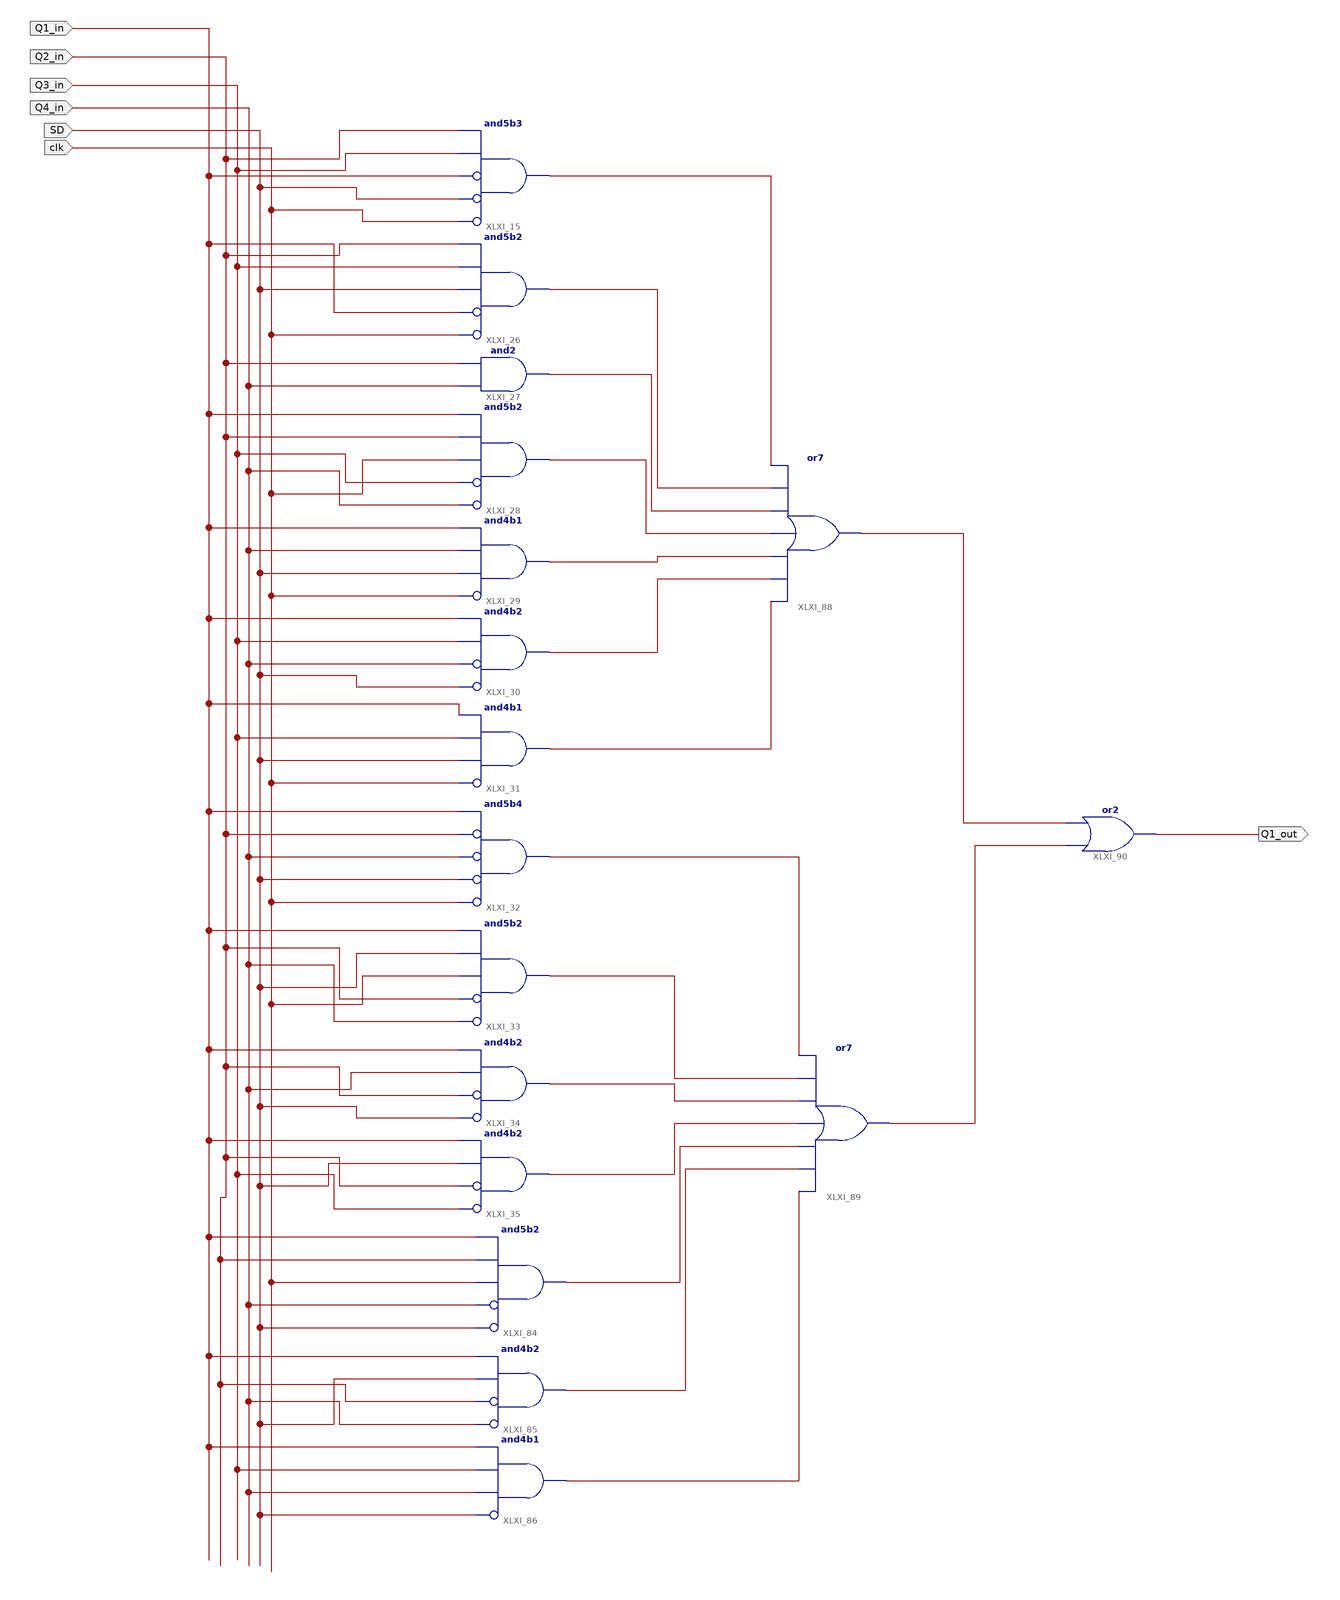
[diagram p0: schematic sheet 1]
// Xilinx ISE schematic Q1_schematic.sch (spartan6) as structural Verilog: 17 symbols, 7 ports
module Q1_schematic (
  input  Q1_in,
  input  Q2_in,
  input  Q3_in,
  input  Q4_in,
  input  clk,
  input  SD,
  output Q1_out
);

  wire XLXN_37, XLXN_38, XLXN_39, XLXN_40, XLXN_41, XLXN_42, XLXN_43, XLXN_44, XLXN_45, XLXN_46, XLXN_47,
       XLXN_48, XLXN_49, XLXN_50, XLXN_51, XLXN_52;

  and XLXI_26 (XLXN_38, ~clk, ~Q1_in, SD, Q3_in, Q2_in);  // and5b2
  and XLXI_27 (XLXN_39, Q4_in, Q2_in);
  and XLXI_28 (XLXN_40, ~Q4_in, ~Q3_in, clk, Q2_in, Q1_in);  // and5b2
  and XLXI_29 (XLXN_41, ~clk, SD, Q4_in, Q1_in);  // and4b1
  and XLXI_30 (XLXN_42, ~SD, ~Q4_in, Q3_in, Q1_in);  // and4b2
  and XLXI_31 (XLXN_43, ~clk, SD, Q3_in, Q1_in);  // and4b1
  and XLXI_32 (XLXN_44, ~clk, ~SD, ~Q4_in, ~Q2_in, Q1_in);  // and5b4
  and XLXI_33 (XLXN_45, ~Q4_in, ~Q2_in, clk, SD, Q1_in);  // and5b2
  and XLXI_34 (XLXN_46, ~SD, ~Q2_in, Q4_in, Q1_in);  // and4b2
  and XLXI_35 (XLXN_47, ~Q3_in, ~Q2_in, SD, Q1_in);  // and4b2
  and XLXI_15 (XLXN_37, ~clk, ~SD, ~Q1_in, Q3_in, Q2_in);  // and5b3
  and XLXI_86 (XLXN_50, ~SD, Q4_in, Q3_in, Q1_in);  // and4b1
  and XLXI_85 (XLXN_49, ~Q4_in, ~Q2_in, SD, Q1_in);  // and4b2
  and XLXI_84 (XLXN_48, ~SD, ~Q4_in, clk, Q2_in, Q1_in);  // and5b2
  or XLXI_88 (XLXN_51, XLXN_43, XLXN_42, XLXN_41, XLXN_40, XLXN_39, XLXN_38, XLXN_37);
  or XLXI_89 (XLXN_52, XLXN_50, XLXN_49, XLXN_48, XLXN_47, XLXN_46, XLXN_45, XLXN_44);
  or XLXI_90 (Q1_out, XLXN_52, XLXN_51);
endmodule
